# EAGLE design left_revision3_1 (EAGLE 7.2.0)
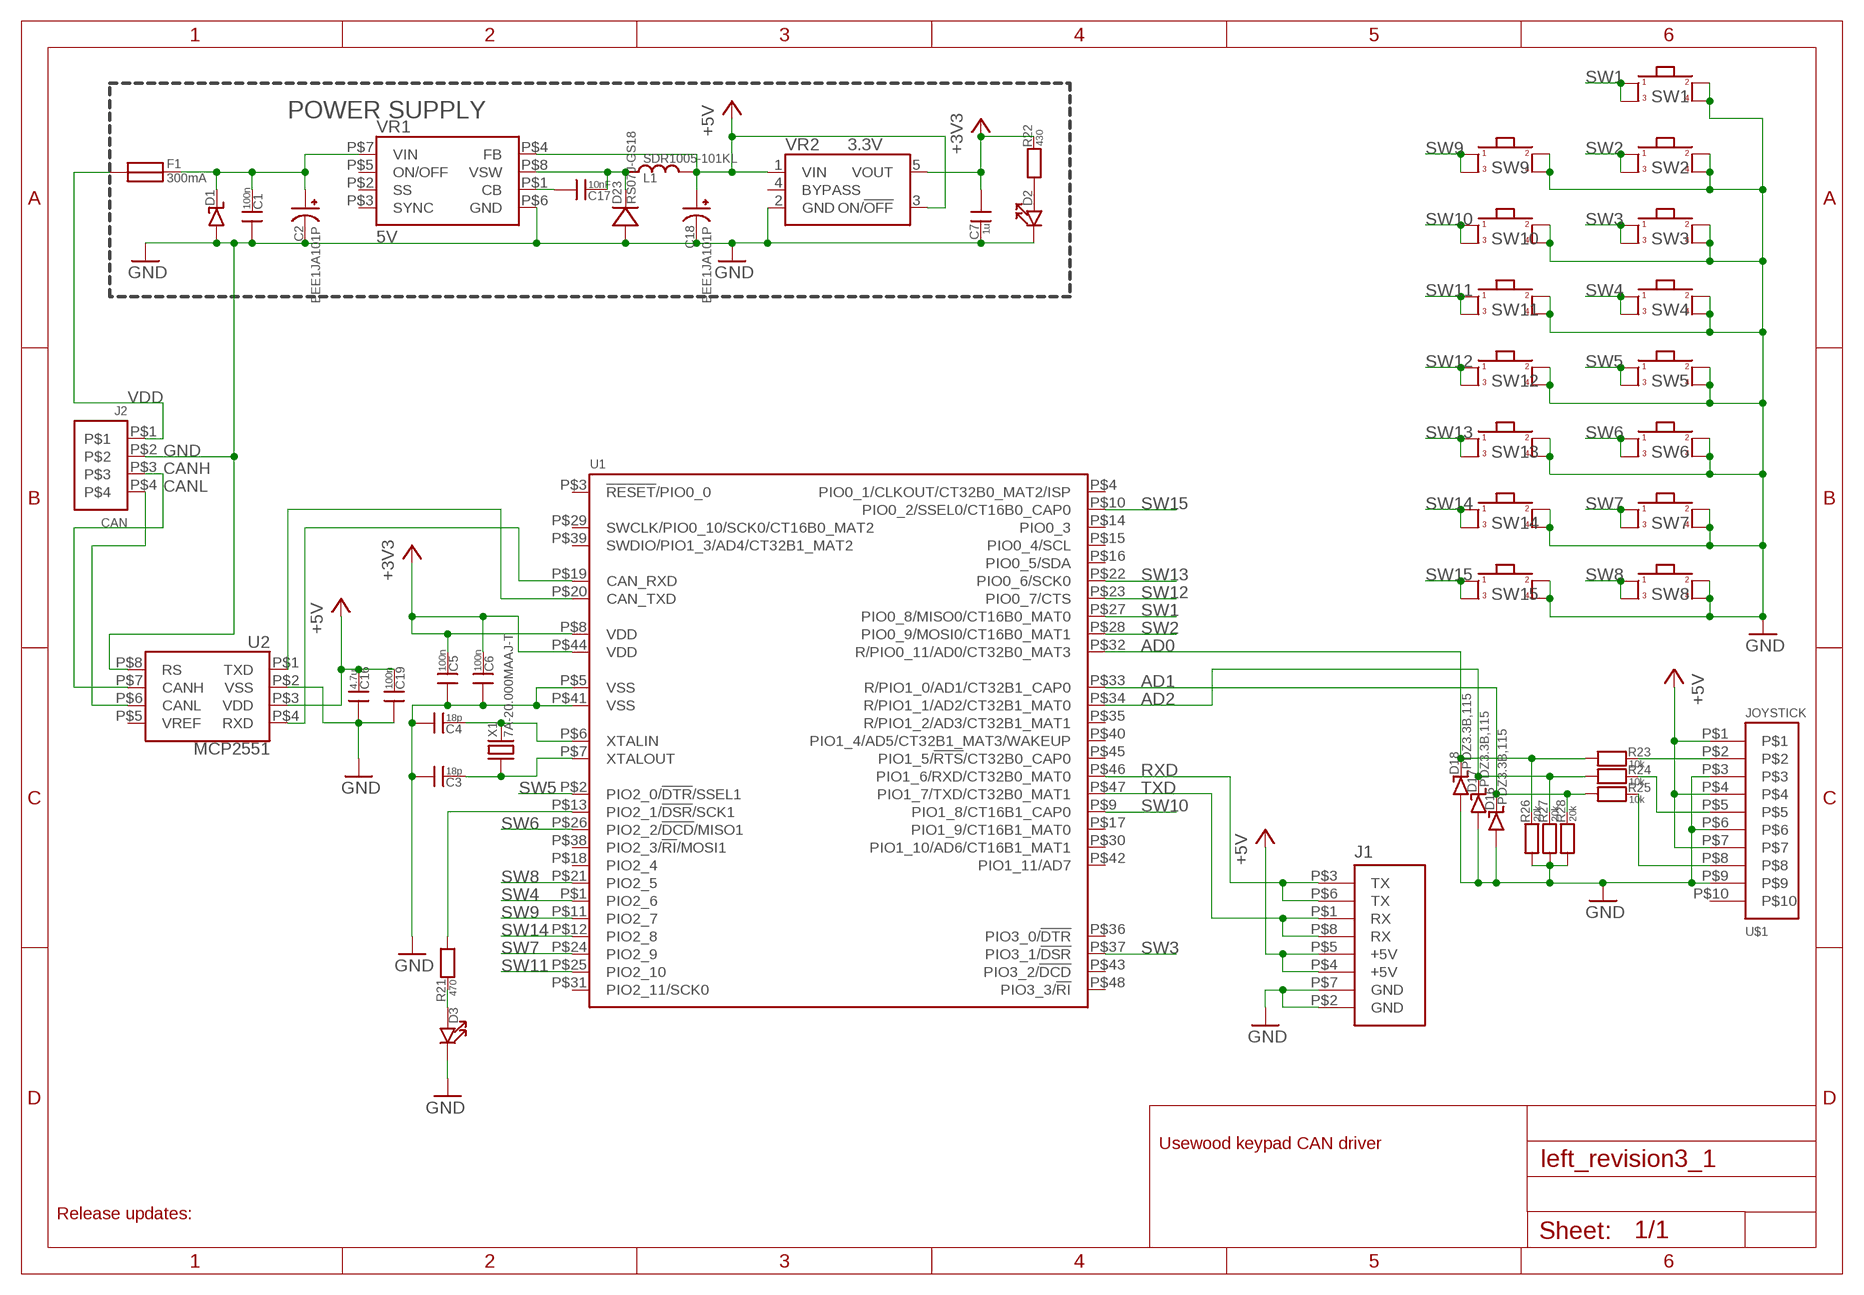
[diagram p0: schematic, sheet 1]

## Parts
C1  100n  CAP_0603  [0603_SILKSCREEN]
C2  EEE1JA101P  CAP_POLSMD_10X10X10MM  [CAP_POL_SMD_10X10X10MM]
C3  18p  CAP_0603  [0603_SILKSCREEN]
C4  18p  CAP_0603  [0603_SILKSCREEN]
C5  100n  CAP_0603  [0603_SILKSCREEN]
C6  100n  CAP_0603  [0603_SILKSCREEN]
C7  1u  CAP_0603  [0603_SILKSCREEN]
C16  4.7u  CAP_0603  [0603_SILKSCREEN]
C17  10nF  CAP_0603  [0603_SILKSCREEN]
C18  EEE1JA101P  CAP_POLSMD_10X10X10MM  [CAP_POL_SMD_10X10X10MM]
C19  100n  CAP_0603  [0603_SILKSCREEN]
D1  DIODE_TVSDO-214AA  [DO-214AB]
D2  LED_0603  [0603_SILKSCREEN]
D3  LED_0603  [0603_SILKSCREEN]
D16  PDZ3.3B,115  DIODE_ZENERSDO123  [SOD123]
D17  PDZ3.3B,115  DIODE_ZENERSDO123  [SOD123]
D18  PDZ3.3B,115  DIODE_ZENERSDO123  [SOD123]
D23  RS07J-GS18  DIODEDO219AB  [DO219AB]
F1  300mA  FUSE_MC36204_100MA  [FUSE_100MA]
J1  HEADER_USART_2_SMD  [HEADER_4_2_SMD]
J2  CAN  MOLEX_MICRO-FIT_4WAY_SMD  [MOLEX_MICRO_FIT_4WAY_SMD]
L1  SDR1005-101KL  INDUCTORBOURNS_10X13X5MM  [INDUCTOR_BOURNS_10X13X5MM]
R21  470  RES_0603  [0603_SILKSCREEN]
R22  430  RES_0603  [0603_SILKSCREEN]
R23  10k  RES_0603  [0603_SILKSCREEN]
R24  10k  RES_0603  [0603_SILKSCREEN]
R25  10k  RES_0603  [0603_SILKSCREEN]
R26  20k  RES_0603  [0603_SILKSCREEN]
R27  20k  RES_0603  [0603_SILKSCREEN]
R28  20k  RES_0603  [0603_SILKSCREEN]
SW1  SWITCH_KMR231G  [SWITCH_KMR231]
SW2  SWITCH_KMR231G  [SWITCH_KMR231]
SW3  SWITCH_KMR231G  [SWITCH_KMR231]
SW4  SWITCH_KMR231G  [SWITCH_KMR231]
SW5  SWITCH_KMR231G  [SWITCH_KMR231]
SW6  SWITCH_KMR231G  [SWITCH_KMR231]
SW7  SWITCH_KMR231G  [SWITCH_KMR231]
SW8  SWITCH_KMR231G  [SWITCH_KMR231]
SW9  SWITCH_KMR231G  [SWITCH_KMR231]
SW10  SWITCH_KMR231G  [SWITCH_KMR231]
SW11  SWITCH_KMR231G  [SWITCH_KMR231]
SW12  SWITCH_KMR231G  [SWITCH_KMR231]
SW13  SWITCH_KMR231G  [SWITCH_KMR231]
SW14  SWITCH_KMR231G  [SWITCH_KMR231]
SW15  SWITCH_KMR231G  [SWITCH_KMR231]
U1  LPC11C14_QFP48  [QFP48]
U2  MCP2551  MCP2551_SOIC8  [SOIC8]
U$1  JOYSTICK  MOLEX_MICRO-FIT_10WAY_SMD  [MOLEX_MICRO_FIT_10WAY_SMD]
VR1  5V  LM2671SOIC8  [SOIC8]
VR2  3.3V  REG_LP2985_SOP5  [SOP5]
X1  7A-20.000MAAJ-T  XTAL_7A-12.000MAAJ-T  [XTAL_SMD_5X3.2]

## Nets
+3V3: C5.1 C6.1 C7.0 R22.1 U1.P$8(VDD) U1.P$44(VDD) VR2.5(VOUT)
+5V: C16.1 C18.+ C19.1 J1.P$4(+5V) J1.P$5(+5V) L1.P$2 U2.P$3(VDD) U$1.P$1 U$1.P$4 U$1.P$7 VR1.P$4(FB) VR2.1(VIN) VR2.3(ON/!OFF)
AD0: D18.P$2(N) R23.0 R26.1 U1.P$32(R/PIO0_11/AD0/CT32B0_MAT3)
AD1: D16.P$2(N) R25.0 R28.1 U1.P$33(R/PIO1_0/AD1/CT32B1_CAP0)
AD2: D17.P$2(N) R24.0 R27.1 U1.P$34(R/PIO1_1/AD2/CT32B1_MAT0)
CANH: J2.P$3 U2.P$7(CANH)
CANL: J2.P$4 U2.P$6(CANL)
GND: C1.0 C2.- C3.0 C4.0 C5.0 C6.0 C7.1 C16.0 C18.- C19.0 D1.P$1(P) D2.1 D3.1 D16.P$1(P) D17.P$1(P) D18.P$1(P) D23.P$1(P) J1.P$2(GND) J1.P$7(GND) J2.P$2 R26.0 R27.0 R28.0 SW1.P$2 SW1.P$4 SW2.P$2 SW2.P$4 SW3.P$2 SW3.P$4 SW4.P$2 SW4.P$4 SW5.P$2 SW5.P$4 SW6.P$2 SW6.P$4 SW7.P$2 SW7.P$4 SW8.P$2 SW8.P$4 SW9.P$2 SW9.P$4 SW10.P$2 SW10.P$4 SW11.P$2 SW11.P$4 SW12.P$2 SW12.P$4 SW13.P$2 SW13.P$4 SW14.P$2 SW14.P$4 SW15.P$2 SW15.P$4 U1.P$5(VSS) U1.P$41(VSS) U2.P$2(VSS) U2.P$8(RS) U$1.P$3 U$1.P$6 U$1.P$9 VR1.P$6(GND) VR2.2(GND)
LED3: D3.0 R21.1
N$2: R21.0 U1.P$13(PIO2_1/!DSR!/SCK1)
N$3: D2.0 R22.0
N$4: C1.1 C2.+ D1.P$2(N) F1.P$2 VR1.P$7(VIN)
N$6: U1.P$20(CAN_TXD) U2.P$1(TXD)
N$11: C17.1 D23.P$2(N) L1.P$1 VR1.P$8(VSW)
N$20: U1.P$19(CAN_RXD) U2.P$4(RXD)
N$32: C17.0 VR1.P$1(CB)
RXD: J1.P$3(TX) J1.P$6(TX) U1.P$46(PIO1_6/RXD/CT32B0_MAT0)
SW1: SW1.P$1 SW1.P$3 U1.P$27(PIO0_8/MISO0/CT16B0_MAT0)
SW2: SW2.P$1 SW2.P$3 U1.P$28(PIO0_9/MOSI0/CT16B0_MAT1)
SW3: SW3.P$1 SW3.P$3 U1.P$37(PIO3_1/!DSR)
SW4: SW4.P$1 SW4.P$3 U1.P$1(PIO2_6)
SW5: SW5.P$1 SW5.P$3 U1.P$2(PIO2_0/!DTR!/SSEL1)
SW6: SW6.P$1 SW6.P$3 U1.P$26(PIO2_2/!DCD!/MISO1)
SW7: SW7.P$1 SW7.P$3 U1.P$24(PIO2_9)
SW8: SW8.P$1 SW8.P$3 U1.P$21(PIO2_5)
SW9: SW9.P$1 SW9.P$3 U1.P$11(PIO2_7)
SW10: SW10.P$1 SW10.P$3 U1.P$9(PIO1_8/CT16B1_CAP0)
SW11: SW11.P$1 SW11.P$3 U1.P$25(PIO2_10)
SW12: SW12.P$1 SW12.P$3 U1.P$23(PIO0_7/CTS)
SW13: SW13.P$1 SW13.P$3 U1.P$22(PIO0_6/SCK0)
SW14: SW14.P$1 SW14.P$3 U1.P$12(PIO2_8)
SW15: SW15.P$1 SW15.P$3 U1.P$10(PIO0_2/SSEL0/CT16B0_CAP0)
TXD: J1.P$1(RX) J1.P$8(RX) U1.P$47(PIO1_7/TXD/CT32B0_MAT1)
VDD: F1.P$1 J2.P$1
XJOY: R23.1 U$1.P$2
XTALIN: C4.1 U1.P$6(XTALIN) X1.P$2
XTALOUT: C3.1 U1.P$7(XTALOUT) X1.P$1
YJOY: R24.1 U$1.P$5
ZJOY: R25.1 U$1.P$8
Unconnected: U1.P$3(!RESET!/PIO0_0) U1.P$4(PIO0_1/CLKOUT/CT32B0_MAT2/ISP) U1.P$14(PIO0_3) U1.P$15(PIO0_4/SCL) U1.P$16(PIO0_5/SDA) U1.P$17(PIO1_9/CT16B1_MAT0) U1.P$18(PIO2_4) U1.P$29(SWCLK/PIO0_10/SCK0/CT16B0_MAT2) U1.P$30(PIO1_10/AD6/CT16B1_MAT1) U1.P$31(PIO2_11/SCK0) U1.P$35(R/PIO1_2/AD3/CT32B1_MAT1) U1.P$36(PIO3_0/!DTR) U1.P$38(PIO2_3/!RI!/MOSI1) U1.P$39(SWDIO/PIO1_3/AD4/CT32B1_MAT2) U1.P$40(PIO1_4/AD5/CT32B1_MAT3/WAKEUP) U1.P$42(PIO1_11/AD7) U1.P$43(PIO3_2/!DCD) U1.P$45(PIO1_5/!RTS!/CT32B0_CAP0) U1.P$48(PIO3_3/!RI) U2.P$5(VREF) U$1.P$10 VR1.P$2(SS) VR1.P$3(SYNC) VR1.P$5(ON/OFF) VR2.4(BYPASS)

## Notes on the sheet
- POWER SUPPLY
- Usewood keypad CAN driver
- Release updates:

## Library data of the parts
C1 C3-C7 C16 C17 C19 = usevolt:CAP; SMD_SIZE: 0603 (1608 metric)
C2 C18 = usevolt:CAP_POL
D1 = arm:DIODE_TVS: 9886257 STMICROELECTRONICS SMBJ33A-TR Product Range:Transil SMBJ Series; TVS Polarity:Unidirectional; Reverse Stand-Off Voltage Vrwm:33V; Diode Case Style:DO-214AA; No. of Pins:2; Breakdown Voltage Min:36.7V; Breakdown Voltage Max:38.6 http://fi.farnell.com/webapp/wcs/stores/servlet/ProductDisplay?catalogId=15001&langId=358&urlRequestType=Base&partNumber=9886257&storeId=10159
D2 D3 = usevolt:LED; SMD_SIZE: 0603 (1608 metric)
D16-D18 = usevolt:DIODE_ZENER
D23 = usevolt:DIODE
F1 = usevolt:FUSE_MC36204_100MA: Carrying Current Max: 10A Holding Current: 100mA Initial Resistance Max: 15ohm Operating Temperature Max: 85°C Operating Voltage: 60VDC PTC Fuse Case Style: SMD Product Range: MC36 Series SVHC: No SVHC (15-Jun-2015) Tripping Current: 300mA; FARNELL_ID: 1861161; MANUFACTURER_ID: MC36204
J1 = usevolt:HEADER_USART_2
J2 = usevolt:MOLEX_MICRO-FIT_4WAY: http://www.farnell.com/datasheets/2016912.pdf MOLEX 43045-0418 Wire-To-Board Connector, Vertical, Micro-Fit 3.0 43045 Series, Surface Mount, Header, 4, 3 mm ★★★★★ ★★★★★ Lisää suosikkeihin Huomasitko virheen? Tulosta sivu MOLEX 43045-0418 Suurenna napsauttamalla Kuva on vain kuvaavaa tarkoitusta varten. Lue tuotekuvaus tarkempia tietoja varten. MOLEX Valmistaja MOLEX Tilauskoodi: 9961429 Valmistajan osanumero 43045-0418 Pakkaus:: Yksittäispakkaus Technical Data Sheet (30.17KB) EN Inne rodzaje opakowania Kela 200/kela 2426308 Tarkista saatavuus ja hinta Tuotteen yleiskatsaus Fully polarized housings Positive latching Locking tang on terminal Back to top Tuotetiedot, asiakirjat ja muuta Product Range Micro-Fit 3.0 43045 Series No. of Contacts 4 Pitch Spacing 3mm Contact Termination Type Surface Mount Gender Header
L1 = usevolt:INDUCTOR
R21-R28 = usevolt:RES; SMD_SIZE: 0603 (1608 metric)
SW1-SW15 = usevolt:SWITCH_KMR231G: http://www.farnell.com/datasheets/1792623.pdf C & K COMPONENTS KMR231G LFS SWITCH, SMD, 3N, SPST, 0.05A, 32VDC ★★★★★ ★★★★★ Lisää suosikkeihin Huomasitko virheen? Tulosta sivu C & K COMPONENTS KMR231G LFS Suurenna napsauttamalla Kuva on vain kuvaavaa tarkoitusta varten. Lue tuotekuvaus tarkempia tietoja varten. C & K COMPONENTS Valmistaja C & K COMPONENTS Tilauskoodi: 1437636 Valmistajan osanumero KMR231G LFS Technical Data Sheet (150.63KB) EN Tuotteen yleiskatsaus The KMR 2 series from C &K Components are surface mount microminiature tactile switches. Top actuated and 1.9mm height switch Maximum voltage of 32VDC SPST-NO contact configuration Maximum current of 50mA(silver) and 10mA (gold) Long life version Available in 1.2N, 2N, 3N and 4N operating forces Optional ground pin Ultra low current capabilities Momentary action Gull wing terminations; FARNELL_ID: 1437636; MANUFACTURER_ID: KMR231G LFS
U1 = usevolt:LPC11C14: http://www.farnell.com/datasheets/1708214.pdf NXP LPC11C14FBD48/301 32 Bit Microcontroller, Low Power, ARM Cortex-M0, 50 MHz, 32 KB, 8 KB, 48, LQFP Lisää suosikkeihin Huomasitko virheen? Tulosta sivu NXP LPC11C14FBD48/301 Suurenna napsauttamalla Kuva on vain kuvaavaa tarkoitusta varten. Lue tuotekuvaus tarkempia tietoja varten. NXP Valmistaja NXP Tilauskoodi: 1812185 Valmistajan osanumero LPC11C14FBD48/301 Technical Data Sheet (322.12KB) EN Tuotteen yleiskatsaus The LPC11C14FBD48/301 is a 32kB flash 8kB SRAM Cortex-M0 Microcontroller Unit designed for 8/16-bit microcontroller applications, offering performance, low power, simple instruction set and memory addressing together with reduced code size compared to existing 8/16-bit architectures. The peripheral complement of the microcontroller with 32kB of flash memory, 8kB of data memory, one fast-mode Plus I²C-bus interface and one RS-485/EIA-485 UART, two SPI interfaces with SSP features, four general purpose counter/timers, a 10-bit ADC and 40 general purpose I/O pins. ARM Cortex-M0 built-in nested vectored interrupt controller Serial wire debug System tick timer High current output driver on one pin Programmable watchdog timer UART with fractional baud rate generation Integrated PMU to minimize power consumption Sovellukset Metering; Industrial; Sensing & Instrumentation Back to top Tuotetiedot, asiakirjat ja muuta Architecture: ARM Cortex-M0 CPU Speed: 50MHz Embedded Interface Type: CAN, I2C, SPI, UART MCU Case Style: LQFP MSL: - No. of I/O's: 40 No. of Pins: 48 Packaging: Each Program Memory Size: 32KB RAM Memory Size: 8KB SVHC: No SVHC (15-Jun-2015) Supply Voltage Max: 3.6V Supply Voltage Min: 1.8V; FARNELL_ID: 1812185; MANUFACTURER_ID: LPC11C14FBD48/301; MOUSER_ID: 771-LPC11C14FD48301
U2 = usevolt:MCP2551: Microchip High-Speed CAN Transceiver Supports 1 Mb/s operation • Implements ISO-11898 standard physical layer requirements • Suitable for 12V and 24V systems • Externally-controlled slope for reduced RFI emissions • Detection of ground fault (permanent dominant) on TXD input • Power-on reset and voltage brown-out protection • An unpowered node or brown-out event will not disturb the CAN bus • Low current standby operation • Protection against damage due to short-circuit conditions (positive or negative battery voltage) • Protection against high-voltage transients • Automatic thermal shutdown protection • Up to 112 nodes can be connected • High noise immunity due to differential bus implementation • Temperature ranges: - Industrial (I): -40°C to +85°C - Extended (E): -40°C to +125°C http://www.digikey.com/product-detail/en/MCP2551T-E%2FSN/MCP2551T-E%2FSNCT-ND/4307904 http://ww1.microchip.com/downloads/en/DeviceDoc/21667f.pdf http://www.farnell.com/datasheets/657417.pdf http://fi.farnell.com/microchip/mcp2551-i-sn/ic-can-transceiver-hi-speed-smd/dp/9758569
U$1 = usevolt:MOLEX_MICRO-FIT_10WAY: http://www.farnell.com/datasheets/1629759.pdf MOLEX 43045-1006 Wire-To-Board Connector, Right Angle, Micro-Fit 3.0 43045 Series, Surface Mount, Header, 10, 3 mm ★★★★★ ★★★★★ Lisää suosikkeihin Huomasitko virheen? Tulosta sivu MOLEX 43045-1006 Suurenna napsauttamalla Kuva on vain kuvaavaa tarkoitusta varten. Lue tuotekuvaus tarkempia tietoja varten. MOLEX Valmistaja MOLEX Tilauskoodi: 1513882 Valmistajan osanumero 43045-1006 Technical Data Sheet (38.25KB) EN Tuotteen yleiskatsaus Fully polarized housings Positive latching Locking tang on terminal Back to top Tuotetiedot, asiakirjat ja muuta Product Range Micro-Fit 3.0 43045 Series No. of Contacts 10 Pitch Spacing 3mm Contact Termination Type Surface Mount Gender Header No. of Rows 2
VR1 = usevolt:LM2671: TEXAS INSTRUMENTS LM2671MX-5.0/NOPB IC, STEP-DOWN REGULATOR, SOIC-8 http://www.farnell.com/datasheets/1874686.pdf
VR2 = usevolt:REG_LP2985: http://www.farnell.com/datasheets/1965480.pdf TEXAS INSTRUMENTS LP2985-33DBVTE4 Fixed LDO Voltage Regulator, 2.2V to 16V, 280mV Dropout, 3.3Vout, 150mAout, SOT-23-5 Lisää suosikkeihin Huomasitko virheen? Tulosta sivu TEXAS INSTRUMENTS LP2985-33DBVTE4 Suurenna napsauttamalla Kuva on vain kuvaavaa tarkoitusta varten. Lue tuotekuvaus tarkempia tietoja varten. TEXAS INSTRUMENTS Valmistaja TEXAS INSTRUMENTS Tilauskoodi: 1053672 Valmistajan osanumero LP2985-33DBVTE4 Technical Data Sheet (1.24MB) EN Tuotteen yleiskatsaus The LP2985-33DBVTE4 is a 150mA 3.3V low quiescent current low noise fixed-output low-dropout regulator available in voltage of 3.3V, the family has an output tolerance of 1.5% for the non-A version and is capable of delivering 150mA continuous load current. Standard regulator features, such as over-current and over-temperature protection are included. 0.01µA Typical Shutdown current 30µVRMS Low noise with 10nF bypass capacitor Stable with low-ESR capacitors, including ceramic Over-current and thermal protection High peak-current capability ESD protection exceeds JESD 22 Green product and no Sb/Br Sovellukset Power Management; Consumer Electronics; Portable Devices This device has limited built-in ESD protection, leads should be shorted together or the device placed in conductive foam during storage or handling to prevent electrostatic damage to the MOS gates. Back to top Tuotetiedot, asiakirjat ja muuta Dropout Voltage Vdo: 280mV Input Voltage Max: 16V Input Voltage Min: 2.2V LDO Regulator Case Style: SOT-23 MSL: MSL 1 - Unlimited No. of Pins: 5 Operating Temperature Max: 125°C Operating Temperature Min: -40°C Output Current: 150mA Output Voltage Nom.: 3.3V Packaging: Cut Tape; FARNELL_ID: 1053672; INPUT_VOLTAGE_MAX: 16 V; MANUFACTURER_ID: LP2985-33DBVTE4; OUTPUT_CURRENT: 150 mA; OUTPU_VOLTAGE: 3.3 V
X1 = usevolt:XTAL_7A-12.000MAAJ-T: http://www.farnell.com/datasheets/1041607.pdf TXC 7A-12.000MAAJ-T XTAL, 12.000MHZ, 18PF, SMD, 5.0X3.2 ★★★★★ ★★★★★ Lisää suosikkeihin Huomasitko virheen? Tulosta sivu TXC 7A-12.000MAAJ-T Suurenna napsauttamalla Kuva on vain kuvaavaa tarkoitusta varten. Lue tuotekuvaus tarkempia tietoja varten. TXC Valmistaja TXC Tilauskoodi: 1841940RL Valmistajan osanumero 7A-12.000MAAJ-T Technical Data Sheet (503.86KB) EN Uudelleenkelauspalvelut Tuotteen yleiskatsaus The 7A-12.000MAAJ-T is a 5 x 3.2mm SMD Glass Sealed Quartz Crystal. It is designed for automatic mounting and reflow soldering. 2 Pads SMD Glass Sealed Crystal Unit High Reliable Environmental Performance Tight Tolerance and Stability Reasonable Cost and Good Delivery Performance Contains Pb in Sealing Glass Exempted by RoHS Directive Ageing ±3ppm Per Year Max Sovellukset Portable Devices; Computers & Computer Peripherals Back to top Tuotetiedot, asiakirjat ja muuta Product Range 7A Series Frequency Nom 12MHz Frequency Stability + / - 30ppm Frequency Tolerance + / - 30ppm Crystal Case SMD, 5mm x 3.2mm Load Capacitance 18pF Operating Temperature Min -40°C Operating Temperature Max 85°C SVHC; FARNELL_ID: 1841940RL; MANUFACTURER_ID: 7A-12.000MAAJ-T

## Board
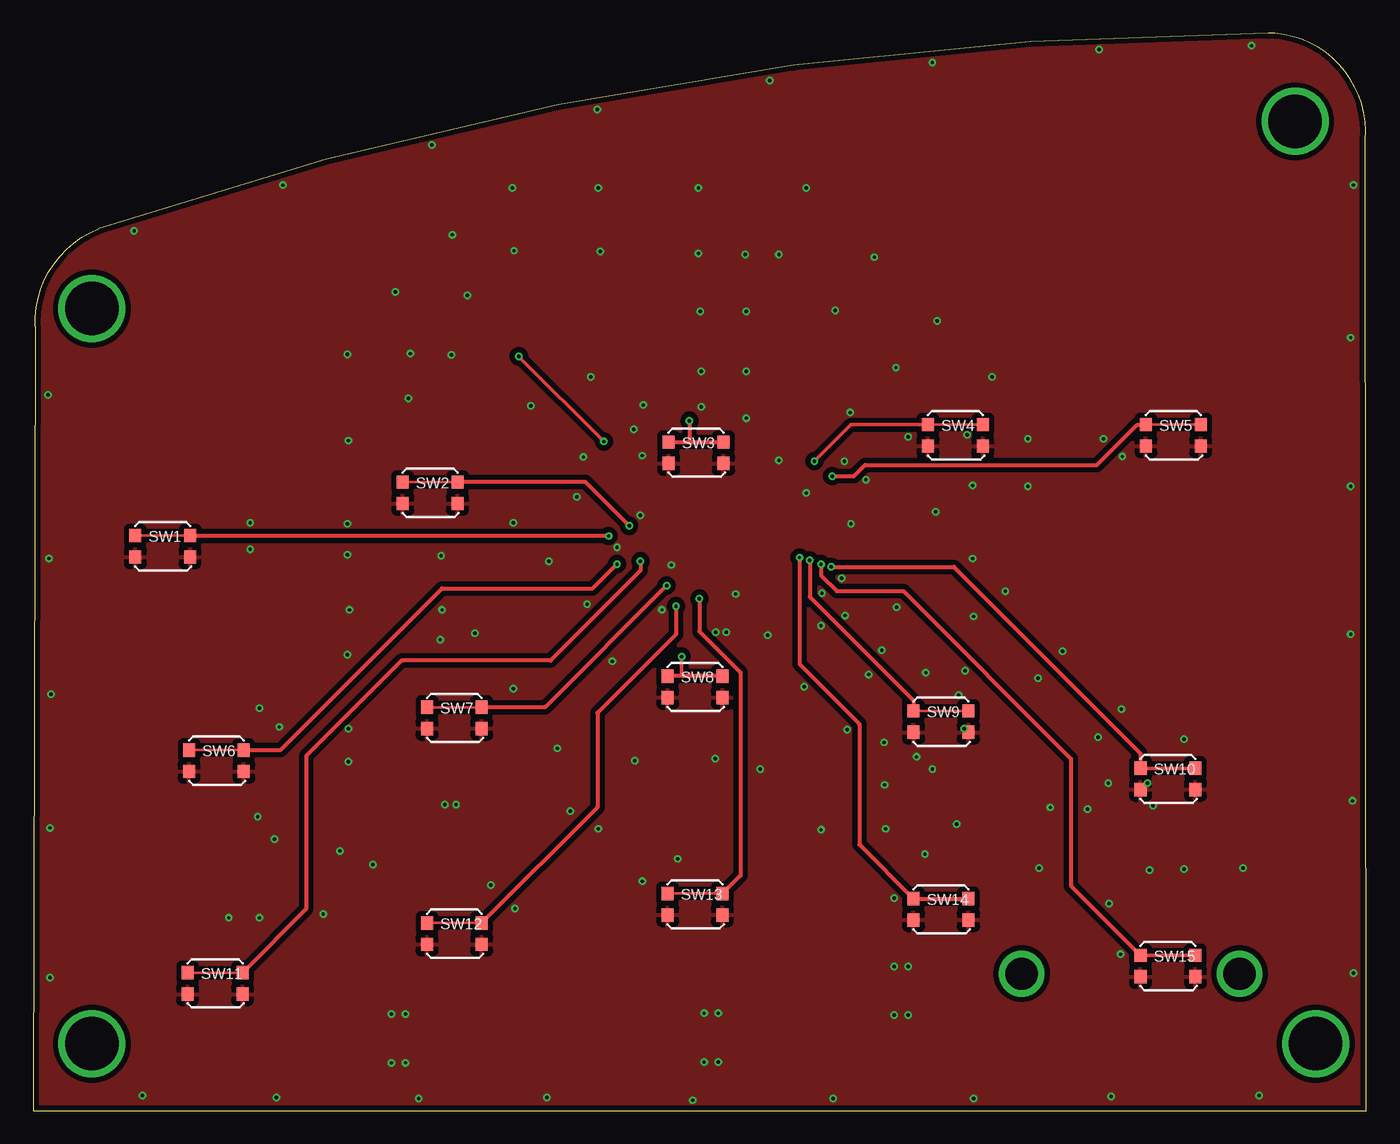
[diagram p1: board, top side]
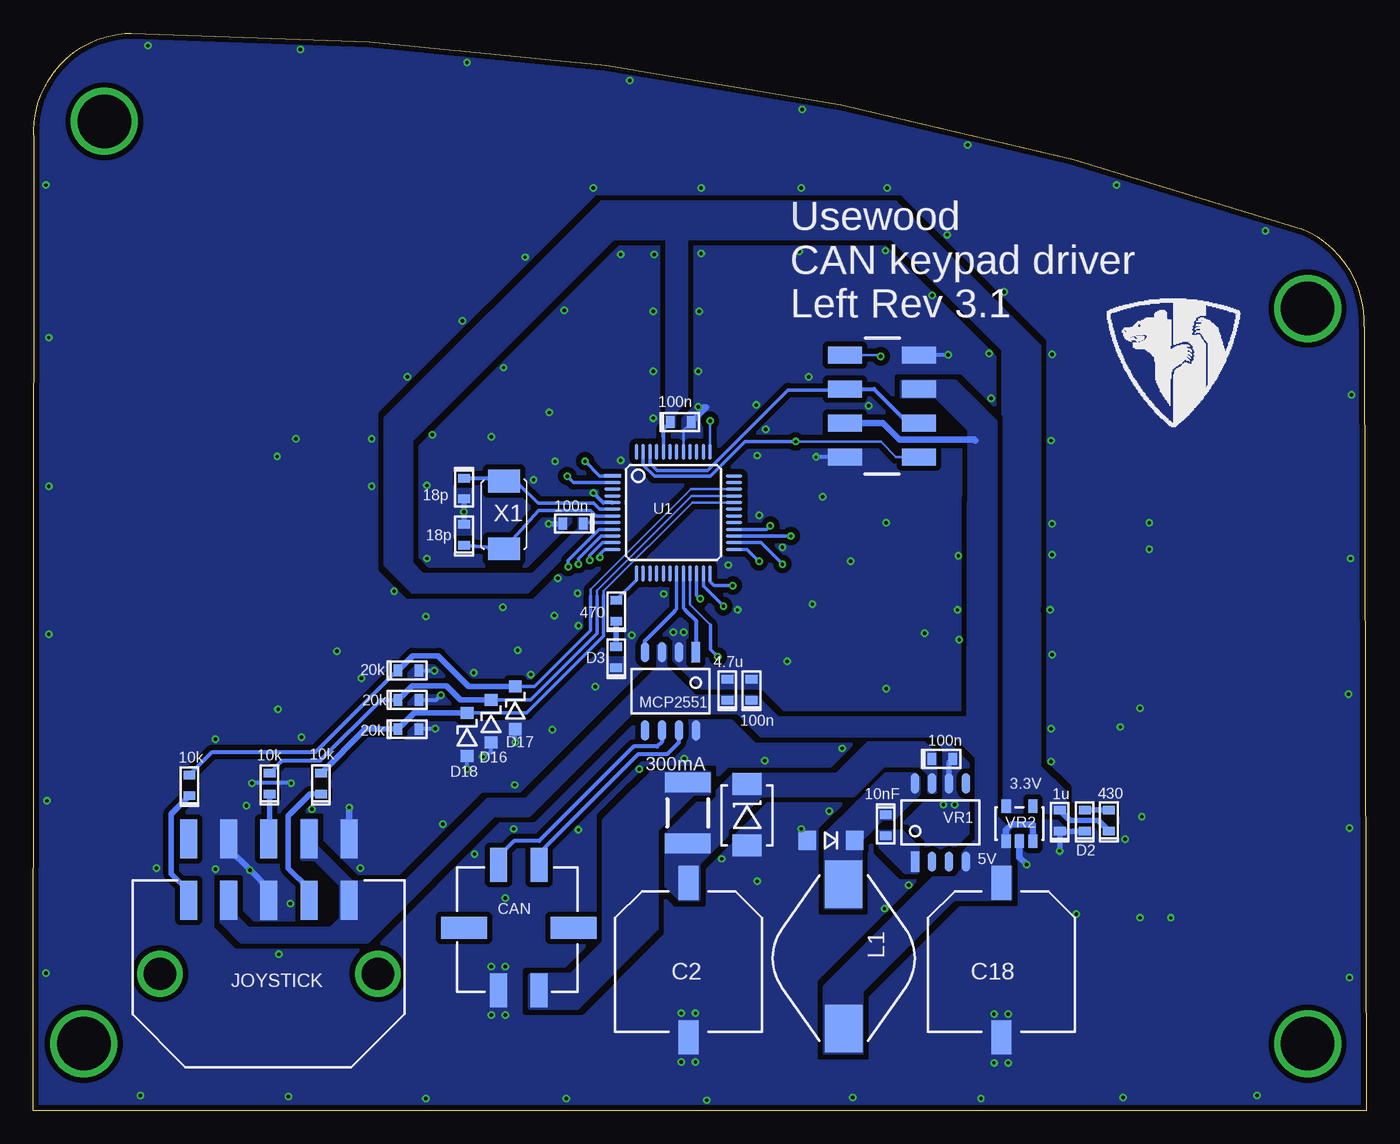
[diagram p2: board, bottom side, seen from below]

Size 99.68 x 80.58 mm. Coordinates in mm from the lower left corner, seen from the top.
Outline: 99.68,0 99.63,72.6 arc90 92.87,80.58 92.37,80.58 arc19 4.89,65.97 arc71 0.14,58.64 0,0 99.68,0
Copper layers (1*16): Top 0.035mm / dielectric 1.5mm / Bottom 0.035mm
Design rules "SeeedStudio_2layer_DRU_no_angle_20140221 *": minimum track width 6mil, minimum drill 8mil, track to track 6mil, track to pad 6mil, pad to pad 6mil, via to via 6mil, smd to smd 0mil, copper to edge 10mil, drill to drill 10mil, minimum pad ring 10mil, minimum via ring 6mil, stop-mask expansion 2mil, vias tented up to drill 100mil, thermal gap 16mil

### Footprints (pad centres in the part's own frame; a part is rotated, then mirrored left to right if it is on the bottom)
0603_SILKSCREEN = smd 0.635 x 0.889: 0 -0.978,0; 1 0.584,0
CAP_POL_SMD_10X10X10MM = smd 1.5 x 2.54: + 0,-0.635; - 0,10.935
DO-214AB = smd 1.62 x 2.18: P$1 0,0; P$2 4.6,0
SOD123 = smd 0.9 x 0.95: P$1 0,0; P$2 3.2,0
DO219AB = smd 1.3 x 1.4: P$1 0,0; P$2 3.535,0
FUSE_100MA = smd 1.5 x 3.41: P$1 0,0; P$2 4.572,0
HEADER_4_2_SMD = smd 2.54 x 1.27: P$1 -0.457,0; P$2 5.08,0; P$3 -0.457,-2.54; P$4 5.08,-2.54; P$5 -0.457,-5.08; P$6 5.08,-5.08; P$7 -0.457,-7.62; P$8 5.08,-7.62
MOLEX_MICRO_FIT_4WAY_SMD = smd 1.27 x 2.54: P$1 1.55,-4.65; P$2 -1.45,-4.65; P$3 1.55,4.75; P$4 -1.45,4.75 | smd 3.43 x 1.65: P$5 4.15,0.05; P$6 -4.05,0.05
INDUCTOR_BOURNS_10X13X5MM = smd 3.556 x 2.8: P$1 -1.754,0; P$2 9.054,0
SWITCH_KMR231 = smd 0.9 x 1: P$1 -2.057,0.813; P$2 -2.057,-0.787; P$3 2.043,0.813; P$4 2.043,-0.787
QFP48 = smd 1.246 x 0.28: P$1 0.327,0; P$2 0.327,-0.5; P$3 0.327,-1; P$4 0.327,-1.5; P$5 0.327,-2; P$6 0.327,-2.5; P$7 0.327,-3; P$8 0.327,-3.5; P$9 0.327,-4; P$10 0.327,-4.5; P$11 0.327,-5; P$12 0.327,-5.5; P$25 9.423,-5.5; P$26 9.423,-5; P$27 9.423,-4.5; P$28 9.423,-4; P$29 9.423,-3.5; P$30 9.423,-3; P$31 9.423,-2.5; P$32 9.423,-2; P$33 9.423,-1.5; P$34 9.423,-1; P$35 9.423,-0.5; P$36 9.423,0 | smd 0.28 x 1.246: P$13 2.125,-7.298; P$14 2.625,-7.298; P$15 3.125,-7.298; P$16 3.625,-7.298; P$17 4.125,-7.298; P$18 4.625,-7.298; P$19 5.125,-7.298; P$20 5.625,-7.298; P$21 6.125,-7.298; P$22 6.625,-7.298; P$23 7.125,-7.298; P$24 7.625,-7.298; P$37 7.625,1.798; P$38 7.125,1.798; P$39 6.625,1.798; P$40 6.125,1.798; P$41 5.625,1.798; P$42 5.125,1.798; P$43 4.625,1.798; P$44 4.125,1.798; P$45 3.625,1.798; P$46 3.125,1.798; P$47 2.625,1.798; P$48 2.125,1.798
SOIC8 = smd 1.524 x 0.635: P$1 -2.286,2.54; P$2 -2.286,1.27; P$3 -2.286,0; P$4 -2.286,-1.27; P$5 3.556,-1.27; P$6 3.556,0; P$7 3.556,1.27; P$8 3.556,2.54
MOLEX_MICRO_FIT_10WAY_SMD = smd 1.27 x 2.92: P$1 -2.15,5.5; P$2 -5.15,5.5; P$3 -8.15,5.5; P$4 -11.15,5.5; P$5 -14.15,5.5; P$6 -2.15,10.1; P$7 -5.15,10.1; P$8 -8.15,10.1; P$9 -11.15,10.1; P$10 -14.15,10.1 | drill 2.41: P$11 0,0; P$12 -16.3,0
SOP5 = smd 0.7 x 1: 1 -1,0; 2 0,0; 3 1,0; 4 1,2.6; 5 -1,2.6
XTAL_SMD_5X3.2 = smd 1.7 x 2.4: P$1 -2.54,0; P$2 2.54,0

### Placement (x,y rotation side)
C1  31.89,26.3 180 bottom
C2  50.67,16.4 180 bottom
C3  67.48,42.87 270 bottom
C4  67.47,46.73 90 bottom
C5  59.13,43.91 0 bottom
C6  51.45,51.5 180 bottom
C7  22.91,21.48 270 bottom
C16  47.77,31.3 270 bottom
C17  35.93,21.54 90 bottom
C18  27.27,16.4 180 bottom
C19  45.97,31.3 270 bottom
D1  46.3,19.84 90 bottom
D2  21.05,21.5 270 bottom
D3  56.09,33.71 270 bottom
D16  65.44,27.53 90 bottom
D17  63.64,28.53 90 bottom
D18  67.24,26.53 90 bottom
D23  41.79,20.21 0 bottom
F1  50.75,24.56 270 bottom
J1  38.51,56.52 0 bottom
J2  63.43,13.63 0 bottom
L1  39.07,15.2 270 bottom
R21  56.09,37.21 270 bottom
R22  19.24,21.5 270 bottom
R23  78.17,24.26 270 bottom
R24  88.02,24.13 270 bottom
R25  82.02,24.26 270 bottom
R26  71.83,28.53 180 bottom
R27  71.83,32.93 180 bottom
R28  71.83,30.72 180 bottom
SW1  9.67,42.2 0 top
SW2  29.67,46.2 0 top
SW3  49.57,49.2 0 top
SW4  68.97,50.5 0 top
SW5  85.27,50.5 0 top
SW6  13.69,26.16 0 top
SW7  31.49,29.36 0 top
SW8  49.49,31.68 0 top
SW9  67.89,29.08 0 top
SW10  84.87,24.8 0 top
SW11  13.59,9.5 0 top
SW12  31.49,13.22 0 top
SW13  49.49,15.42 0 top
SW14  67.89,15.04 0 top
SW15  84.87,10.8 0 top
U1  56.69,47.48 0 bottom
U2  52.67,32 270 bottom
U$1  73.93,10.23 0 bottom
VR1  31.19,20.91 90 bottom
VR2  25.93,20.16 0 bottom
X1  64.49,44.56 90 bottom

### Tracks (layer width: path | path; a pad name or v marks a point on that pad's centre or on a via)
+3V3
  Bottom 0.25: U1.P$8 58.47,43.98 | U1.P$44 52.57,50.42 52.56,50.43
  Bottom 0.3: 58.47,43.98 C5.1 | 52.56,50.43 52.56,50.97 C6.1
  Bottom 0.4: R22.1 20.02,21.7 22.15,21.7 C7.0
  pour Bottom (isolate 0.4, rank 2, no thermals): 27.13,22.4 27.13,56.89 35.48,65.24 50.86,65.24 50.86,53.13 51.77,52.22 51.77,51.17 52.26,51.17 52.26,65.24 56.32,65.24 71.44,50.12 71.44,40.95 70.6,40.11 62.27,40.11 58.84,43.54 58.84,44.31 58.28,44.31 58.28,43.26 62.76,38.78 71.3,38.78 73.33,40.81 73.33,51.8 57.16,67.97 35.23,67.97 24.47,57.21 24.47,25.76 22.58,23.87 22.58,22.33 22.65,22.26 23.35,22.26 26.64,22.33 27.06,22.33
+5V
  Bottom 0.5: VR2.3 24.93,21.42 26.5,21.42 26.92,21 VR2.1 | J1.P$5 36.15,51.44 34.9,50.19 29.3,50.19 29.23,50.12
  pour Bottom (no thermals): 40.5,4.34 37.7,4.34 37.7,8.96 30.84,15.82 26.57,15.82 26.57,18.2 26.71,18.34 26.71,21 27.69,21.98 27.69,51.52 30.7,54.53 34.76,54.53 34.76,53.41 32.17,53.41 29.72,50.96 29.79,29.33 44,29.33 45.61,30.94 50.16,30.94 52.4,33.18 52.4,34.72 52.61,34.93 52.75,34.93 52.96,34.72 52.96,33.11 62.83,23.24 65.7,23.24 71.86,17.08 75.85,17.08 78.51,19.74 78.51,21.7 79.63,21.7 79.63,18.83 78.65,18.83 76.69,16.87 76.69,14.35 77.46,13.58 83.62,13.58 84.53,14.49 84.53,17.08 85.65,17.08 85.65,14.14 84.18,12.67 74.66,12.67 65.21,22.12 62.55,22.12 54.85,29.82 47.01,29.82 45.26,28.07 30.77,28.07 29.16,26.46 29.16,20.23 30.14,19.25 30.14,17.99 30.77,17.36 32.38,17.36 40.5,9.24
AD0
  Bottom 0.2: 57.02,38.57 57.02,38.85 50.39,45.48 U1.P$32
  Bottom 0.25: D18.P$2 62.78,29.73 57.02,35.49 57.02,38.57
  Bottom 0.4: R23.0 74.87,28.53 R26.1 71.22,29.73 D18.P$2
AD1
  Bottom 0.2: 57.51,38.5 57.51,38.92 50.45,45.98 U1.P$33
  Bottom 0.25: D16.P$2 62.48,30.73 57.51,35.7 57.51,38.5
  Bottom 0.3: R25.0 81.08,26.18 78.23,26.18 73.69,30.72 R28.1
  Bottom 0.4: R28.1 71.35,31.78 68.78,31.78 67.73,30.73 D16.P$2
AD2
  Bottom 0.2: 58,38.5 58,38.99 50.51,46.48 U1.P$34
  Bottom 0.25: D17.P$2 62.18,31.73 58,35.91 58,38.5
  Bottom 0.3: R24.0 86.31,26.81 78.58,26.81 72.47,32.93 R27.1
  Bottom 0.4: R27.1 71.32,34.02 69.41,34.02 67.12,31.73 D17.P$2
CANH
  Bottom 0.3: J2.P$3 61.88,19.22 54.43,26.67 52.26,26.67 51.4,27.53 U2.P$7
CANL
  Bottom 0.3: U2.P$6 52.67,27.59 53.03,27.23 54.78,27.23 61.85,20.16 63.74,20.16 64.72,19.18 64.72,18.53 J2.P$4
GND  (via drill 0.25)
  Bottom 0.2: U1.P$41 51.07,50.9 C6.0
  Bottom 0.3: v31.26,56.53 31.3,56.52 J1.P$2 | J1.P$7 39.02,48.89 v41.14,48.89 | v67.24,25.55 D18.P$1 | v66.05,26.46 65.44,26.86 D16.P$1 | v63.64,27.54 D17.P$1 | v69.62,28.56 69.65,28.53 R26.0 | R28.0 69.56,30.72 v69.2,31.08 | R27.0 69.72,32.93 v69.69,32.9 | v80.4,24.5 83.2,24.5 | U1.P$5 57.07,45.48 v57.79,46.2
  Bottom 0.4: v22.92,19.42 22.91,19.43 C7.1 21.07,20.9 D2.1 | C1.0 31.19,26.02 VR1.P$6 | C6.0 49.33,52.64 v49.95,52.64 | C5.0 60.12,43.89 v61.15,43.89 | C4.0 67.48,45.74 C3.0
  Bottom 0.5: U$1.P$3 82.08,16.58 v83.48,17.99 85.08,19.58 U$1.P$9 | U$1.P$6 76.06,20.35 v76.06,22.68 | VR2.2 25.93,18.95 v25.38,18.41
  other vias: 30.42,35.21 64.37,10.78 65.42,10.78 65.42,7.14 64.37,7.14 50.16,7.28 51.21,7.28 51.21,3.64 50.16,3.64 26.78,7.21 27.83,7.21 27.83,3.57 26.78,3.57 31.61,22.89 30.77,22.89 67.48,44.8 51.04,35.77 51.81,35.77 69.83,50.54 60.66,48.58 55.76,48.65 53.31,51.8 53.31,55.3 53.31,59.78 59.96,59.85 64.51,55.58 55.76,64.05 53.24,64.05 72.7,38.85 70.25,41.3 70.25,46.76 74.38,46.69 74.38,50.26 71.72,54.88 67.59,59.08 62.9,63.84 57.79,69.02 49.74,69.02 42.25,69.02 35.81,69.02 31.33,65.52 27.06,61.25 23.49,56.56 23.56,50.12 23.49,41.58 23.63,37.45 30.56,37.45 30.49,41.51 35.88,43.96 45.4,44.52 45.54,49 45.61,52.78 49.95,55.3 41.69,54.88 28.04,53.27 28.18,56.63 32.45,60.97 35.95,64.33 42.39,64.26 49.74,64.12 49.88,59.78 48.2,18.83 45.54,17.15 44.98,26.18 51,26.32 39.17,27.09 34.2,16.87 36.02,15.12 38.4,0.98 28.81,0.91 18.17,0.98 8.16,1.12 49.32,0.77 59.82,0.91 70.32,0.91 80.61,1.05 91.67,1.12 81.31,11.69 75.22,18.13 78.86,22.54 69.06,21.42 66.68,19.18 63.74,21.07 47.01,37.45 43.3,33.6 35.88,31.57 33.01,35.7 23.56,28.56 23.49,34.09 18.38,28.7 16.91,30.1 16.77,21.98 18.03,20.3 16.91,14.42 14.6,14.42 1.23,9.94 1.23,21.14 1.3,31.15 1.16,41.3 1.09,53.55 7.53,65.8 18.66,69.23 29.79,72.24 42.18,74.9 16.21,43.96 16.21,42 23.49,43.89 38.54,41.09 47.71,40.81 80.05,50.26 81.45,48.93 83.76,22.82 98.74,10.29 98.67,23.17 98.53,35.63 98.53,46.69 55.06,77.07 67.24,78.4 79.7,79.38 91.11,79.66 98.74,69.23 98.53,57.82 86.07,18.06 83.34,24.5 63.67,24.36 57.65,31.71 54.92,35.56 52.54,38.64 60.73,37.03 63.46,34.44 75.15,32.34 64.58,37.66 66.75,32.76 70.32,36.96 79.63,27.93 58.91,21 54.36,25.55 23.56,26.11 81.38,30.03 76.97,34.37 86.07,27.79 90.48,18.13 62.27,47.18 44.91,50.96 37.21,52.71 60.45,39.83 58.98,38.71 62.48,32.62 58.91,36.26 60.87,28.49 42.25,21.07 40.15,22.4 40.64,45.92 43.65,42.14 41.41,37.87 21.67,14.7 64.37,15.89 80.47,15.47 61.08,52.22 65.42,50.4
  pour Bottom (no thermals): 64.09,7.21 64.37,6.93 65.42,6.93 65.63,7.14 65.63,10.78 65.49,10.92 64.3,10.92 64.09,10.71
  pour Bottom (no thermals): 49.88,3.71 50.16,3.43 51.21,3.43 51.42,3.64 51.42,7.28 51.28,7.42 50.09,7.42 49.88,7.21
  pour Bottom (no thermals): 26.5,3.64 26.78,3.36 27.83,3.36 28.04,3.57 28.04,7.21 27.9,7.35 26.71,7.35 26.5,7.14
  pour Bottom (no thermals): 31.82,22.82 31.68,22.68 30.7,22.68 30.56,22.82 30.56,23.03 30.98,23.45 30.98,25.06 31.4,25.06 31.4,23.45 31.82,23.03
  pour Bottom (no thermals): 51.21,34.58 51.21,33.74 51.35,33.6 51.42,33.6 51.63,33.81 51.63,35.07 51.98,35.42 51.98,35.84 51.84,35.98 51,35.98 50.86,35.84 50.86,35.49 51.21,35.14
  pour Bottom (isolate 0.4, rank 6, no thermals): 0,0 0,59.21 arc-16 0.18,60.48 arc-50 4.87,65.87 arc-8 5.64,66.15 arc4 9.14,67.27 arc-8 32.24,73.64 arc2 39.1,75.11 arc-4 47.85,76.79 arc-2 62.13,78.75 arc-5 83.34,80.29 arc-1 92.16,80.43 arc-91 99.58,73.01 99.65,0
  pour Top (isolate 0.4, rank 6): 0,0 0,59.21 arc-16 0.18,60.48 arc-50 4.87,65.87 arc-8 5.64,66.15 arc4 9.14,67.27 arc-8 32.24,73.64 arc2 39.1,75.11 arc-4 47.85,76.79 arc-2 62.13,78.75 arc-5 83.34,80.29 arc-1 92.16,80.43 arc-91 99.58,73.01 99.65,0
LED3
  Bottom 0.4: R21.1 D3.0
N$2
  Bottom 0.25: R21.0 54.57,39.7 U1.P$13
N$3
  Bottom 0.4: R22.0 D2.0
N$4
  pour Bottom (no thermals): 49.95,15.75 51.28,15.75 52.33,16.8 52.33,20.65 50.02,22.96 48.97,22.96 48.48,23.45 48.48,23.94 47.29,25.13 39.59,25.13 37.21,27.51 33.08,27.51 32.24,26.67 32.24,23.8 32.66,23.8 32.66,25.13 33.36,25.83 36.09,25.83 38.33,23.59 45.26,23.59 47.85,21 47.85,20.58 49.95,18.48
N$6
  Bottom 0.25: U1.P$20 51.07,37.59 50.93,37.45
  Bottom 0.3: 50.93,37.45 50.13,36.65 U2.P$1
N$7  (via drill 4)
  other vias: 95.92,5
N$8  (via drill 4)
  other vias: 4.37,5
N$9  (via drill 4)
  other vias: 4.37,60
N$10  (via drill 4)
  other vias: 94.37,74
N$11
  pour Bottom (no thermals): 33.43,23.73 33.43,24.85 33.71,25.13 35.95,25.13 38.05,23.03 40.43,20.65 40.43,15.19 37.77,15.19 37.77,20.23 36.16,21.84 35.32,21.84
N$20
  Bottom 0.25: 51.7,37.38 51.57,37.52 U1.P$19
  Bottom 0.3: U2.P$4 53.94,35.14 51.7,37.38
N$32
  pour Bottom (no thermals): 33.5,17.92 33.5,19.67 34.69,20.86 36.37,20.86 36.37,19.74 34.48,17.85 33.57,17.85
RXD
  Bottom 0.2: 39.59,53.9 39.51,53.98 J1.P$3
  Bottom 0.25: U1.P$46 53.57,48.41 53.03,47.88 49.25,47.88 43.23,53.9 39.59,53.9
  Bottom 0.3: J1.P$3 36.8,53.98 34.26,51.44 J1.P$6
SW1  (via drill 0.25)
  Top 0.2: SW1.P$3 SW1.P$1
  Top 0.3: v43.02,42.98 11.75,42.98 SW1.P$3
  Bottom 0.25: U1.P$27 v43.02,42.98
SW2  (via drill 0.25)
  Top 0.2: SW2.P$3 SW2.P$1
  Top 0.3: v44.56,43.75 41.3,47.01 SW2.P$3
  Bottom 0.25: U1.P$28 44.83,43.48 v44.56,43.75
SW3  (via drill 0.25)
  Top 0.3: SW3.P$1 49.04,50.01 | 49.04,50.01 SW3.P$3 | v49.06,51.6 49.06,50.03 49.04,50.01
  Bottom 0.2: U1.P$37 v49.07,51.59 v49.06,51.6
SW4  (via drill 0.25)
  Top 0.2: SW4.P$1 SW4.P$3
  Top 0.25: v58.42,48.58 61.16,51.31 SW4.P$1
  Bottom 0.25: U1.P$1 57.32,47.48 v58.42,48.58
SW5  (via drill 0.25)
  Top 0.2: SW5.P$3 SW5.P$1
  Top 0.3: v59.75,47.46 61.36,47.46 62.2,48.3 79.56,48.3 82.58,51.31 SW5.P$1
  Bottom 0.25: U1.P$2 59.27,46.98 v59.75,47.46
SW6  (via drill 0.25)
  Top 0.2: SW6.P$3 SW6.P$1
  Top 0.3: SW6.P$3 18.48,26.97 30.56,39.06 41.83,39.06 v43.65,40.88
  Bottom 0.25: v43.65,40.88 45.25,42.48 U1.P$26
SW7  (via drill 0.25)
  Top 0.2: SW7.P$3 SW7.P$1
  Top 0.3: v47.36,39.27 38.27,30.17 SW7.P$3
  Bottom 0.25: U1.P$24 49.07,39.58 48.76,39.27 v47.36,39.27
SW8  (via drill 0.25)
  Top 0.25: v48.48,33.95 48.48,32.63 48.62,32.49
  Top 0.3: SW8.P$3 48.62,32.49 SW8.P$1
  Bottom 0.2: U1.P$21 50.57,37.85 49.04,36.33
  Bottom 0.25: 49.04,36.33 49.04,34.51 v48.48,33.95
SW9  (via drill 0.25)
  Top 0.2: SW9.P$1 SW9.P$3
  Top 0.3: v58.07,41.16 58.07,38.42 65.84,30.66 SW9.P$1
  Bottom 0.25: U1.P$11 57.1,42.48 58.07,41.51 v58.07,41.16
SW10  (via drill 0.25)
  Top 0.25: SW10.P$3 SW10.P$1
  Top 0.3: v59.68,40.67 68.85,40.67 82.82,26.71 SW10.P$1
  Bottom 0.25: U1.P$9 57.36,43.48 59.68,41.16 v59.68,40.67
SW11  (via drill 0.25)
  Top 0.2: SW11.P$3 SW11.P$1
  Top 0.3: v45.4,41.09 45.4,40.39 38.68,33.67 27.55,33.67 20.41,26.53 20.41,15.09 SW11.P$3
  Bottom 0.25: U1.P$25 46.29,41.98 v45.4,41.09
SW12  (via drill 0.25)
  Top 0.2: SW12.P$3 SW12.P$1
  Top 0.3: v48.06,37.73 48.06,35.63 42.18,29.75 42.18,22.68 SW12.P$3
  Bottom 0.25: U1.P$23 49.57,39.23 v48.06,37.73
SW13  (via drill 0.25)
  Top 0.2: SW13.P$1 SW13.P$3
  Top 0.3: v49.81,38.29 49.81,35.84 52.89,32.76 52.89,17.59 SW13.P$3
  Bottom 0.25: U1.P$22 50.07,38.55 v49.81,38.29
SW14  (via drill 0.25)
  Top 0.3: SW14.P$3 SW14.P$1 61.78,19.91 61.78,28.91 57.3,33.39 v57.3,41.37
  Bottom 0.25: U1.P$12 56.97,41.98 57.3,41.65 v57.3,41.37
SW15  (via drill 0.25)
  Top 0.25: SW15.P$3 SW15.P$1
  Top 0.3: v58.91,40.88 58.91,40.04 60.1,38.85 65.07,38.85 77.6,26.32 77.6,16.82 SW15.P$1
  Bottom 0.25: U1.P$10 57.23,42.98 58.91,41.3 v58.91,40.88
TXD  (via drill 0.25)
  Top 0.25: v42.67,50.05 v36.3,56.42
  Bottom 0.2: v42.67,50.05 36.3,50.05 35.15,48.9 J1.P$8 | v36.3,56.42 36.4,56.52 J1.P$1
  Bottom 0.25: U1.P$47 54.07,48.28 53.24,47.46 49.04,47.46 46.45,50.05 v42.67,50.05
VDD
  pour Bottom (no thermals): 62.55,7.7 58.98,7.7 53.73,12.95 53.03,13.65 53.03,21 50.3,23.73 49.11,23.73 49.11,25.27 53.45,25.27 55.9,22.82 57.02,21.7 57.02,12.6 59.47,10.15 62.48,10.15 62.55,10.08
XJOY
  Bottom 0.4: U$1.P$2 79.08,16.59 80.61,18.13 80.61,22.05 78.99,23.67 R23.1
XTALIN
  Bottom 0.25: X1.P$2 63.34,46.85 61.92,45.43 57.79,45.43 57.34,44.98 U1.P$6
  Bottom 0.3: C4.1 64.96,47.31 X1.P$2
XTALOUT
  Bottom 0.25: U1.P$7 57.61,44.48 58,44.87 61.9,44.87 X1.P$1
  Bottom 0.3: X1.P$1 67.46,42.27 C3.1
YJOY
  Bottom 0.4: U$1.P$5 88.08,16.42 89.36,17.71 89.36,22.19 R24.1
ZJOY
  Bottom 0.4: U$1.P$8 82.02,20.39 R25.1

### Text on the board
bPlace: Usewood / CAN keypad driver / Left Rev 3.1